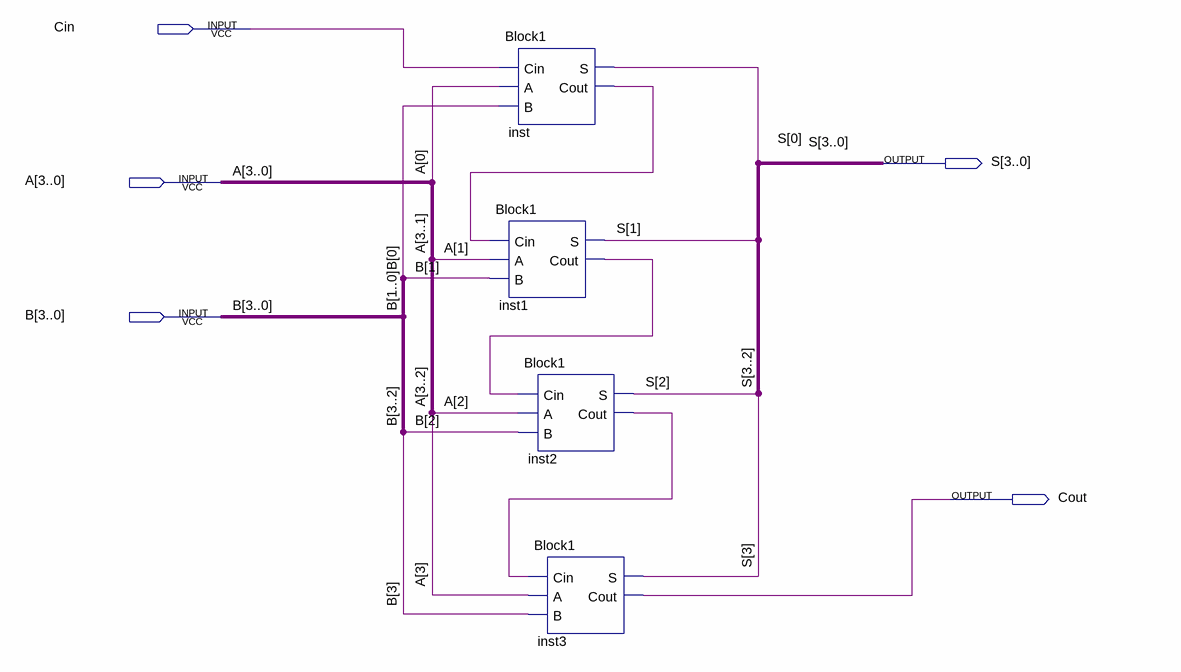
[diagram p0: schematic sheet]
// Quartus schematic 4bitfulladder.bdf as structural Verilog: 4 symbols, 5 pins
module \4bitfulladder  (
  input  Cin,
  input  [3:0] A,
  input  [3:0] B,
  output [3:0] S,
  output Cout
);

  wire inst1_cout, inst2_cout, inst_cout;

  Block1 inst1 (.Cin(inst_cout), .A(A[1]), .B(B[1]), .S(S[1]), .Cout(inst1_cout));
  Block1 inst (.Cin(Cin), .A(A[0]), .B(B[0]), .S(S[0]), .Cout(inst_cout));
  Block1 inst2 (.Cin(inst1_cout), .A(A[2]), .B(B[2]), .S(S[2]), .Cout(inst2_cout));
  Block1 inst3 (.Cin(inst2_cout), .A(A[3]), .B(B[3]), .S(S[3]), .Cout(Cout));
endmodule
